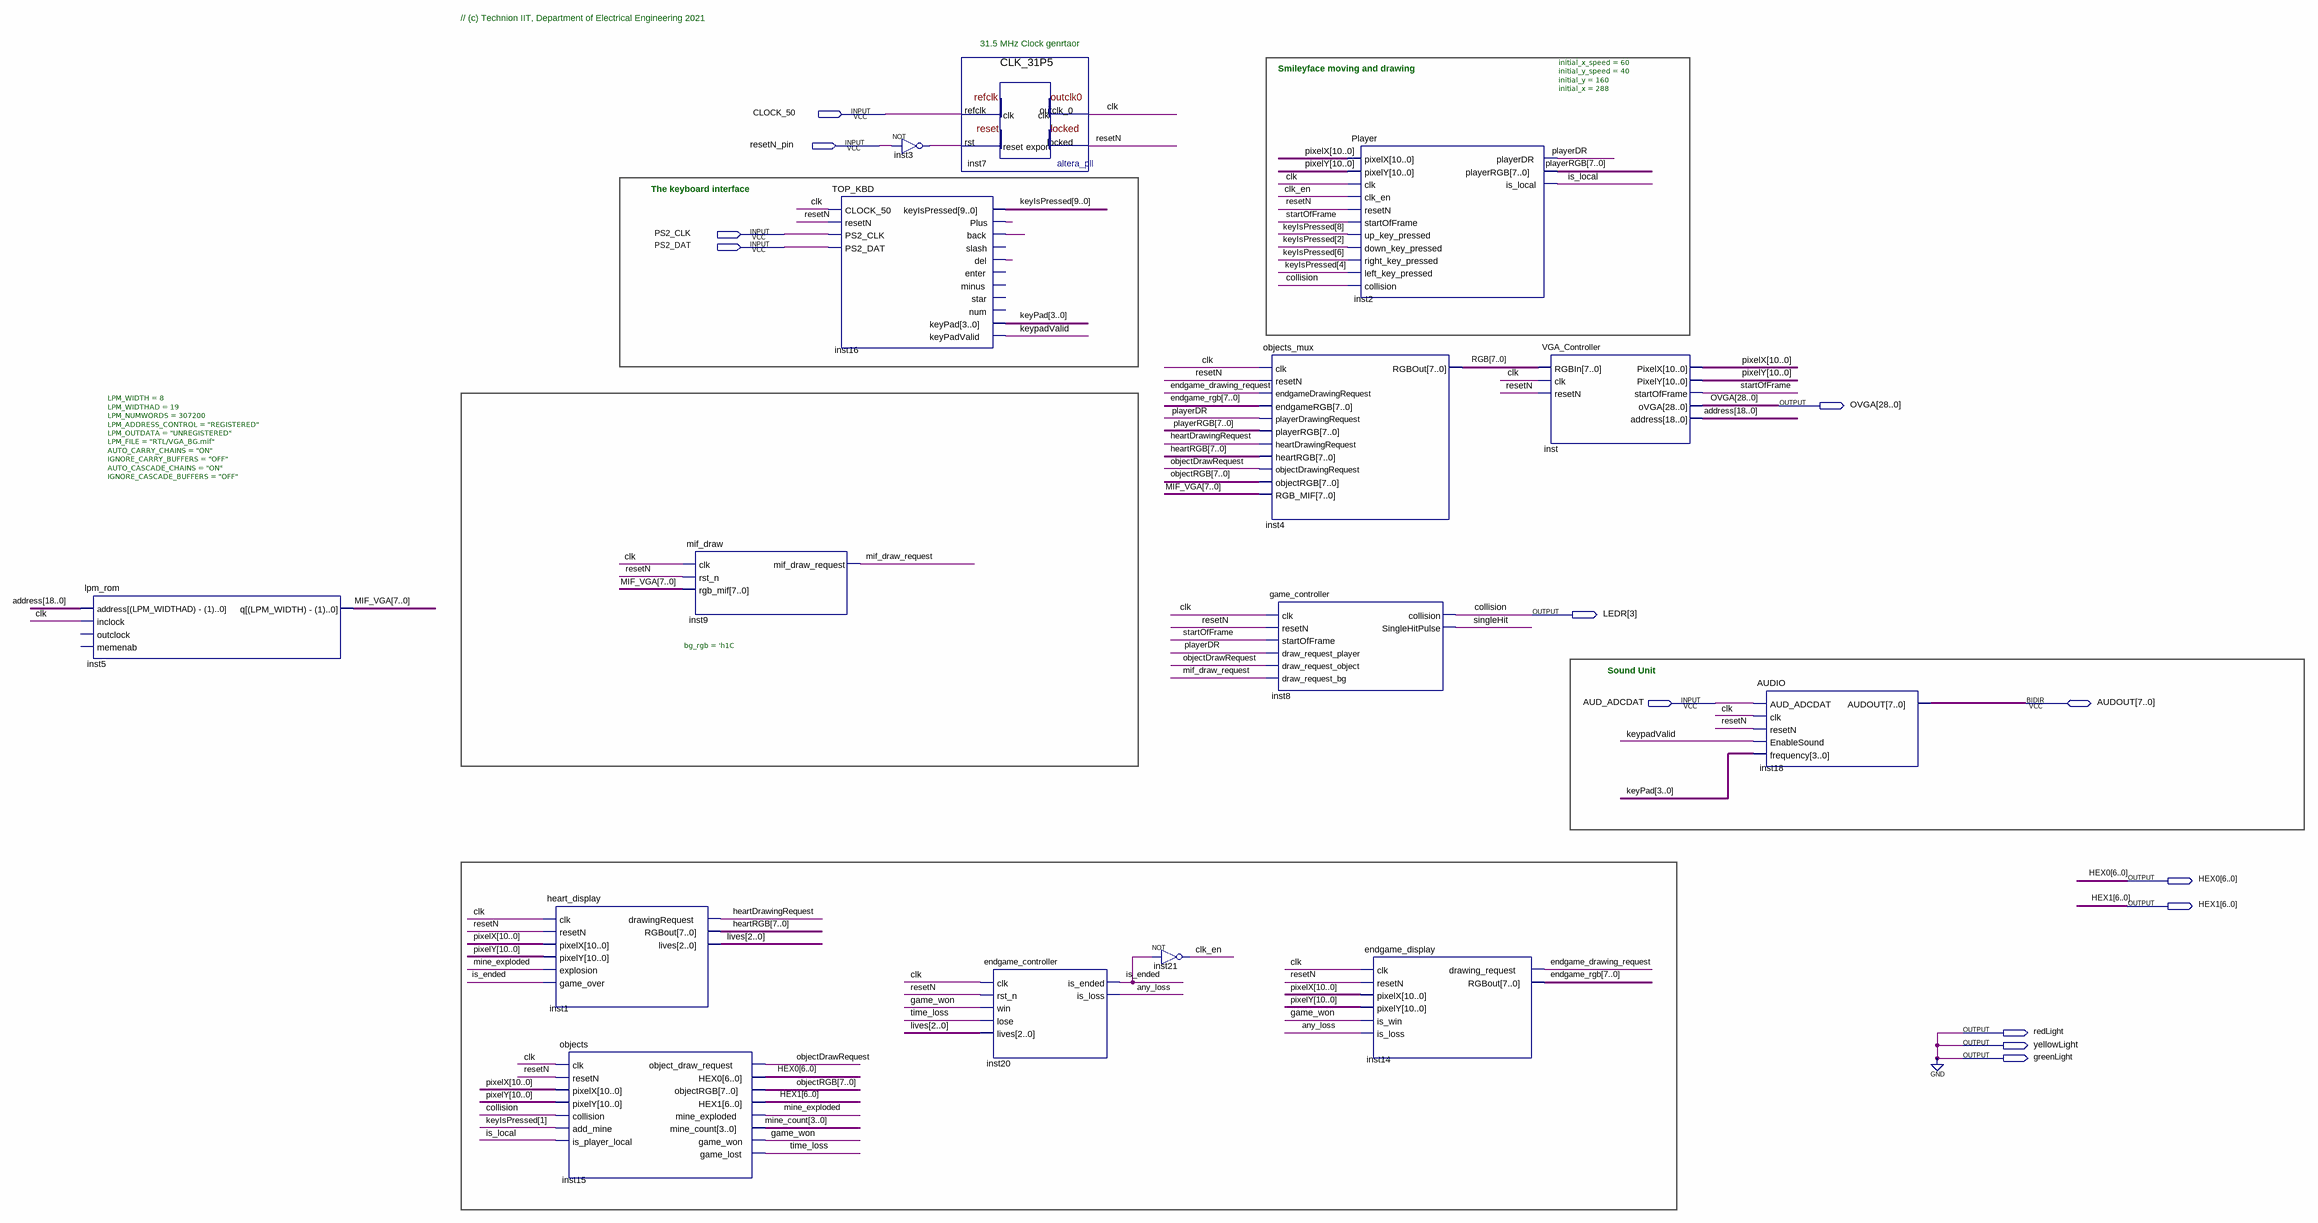
[diagram p0: schematic sheet]
// Quartus schematic TOP.bdf as structural Verilog: 15 symbols, 13 pins
module TOP (
  input  CLOCK_50,
  input  resetN_pin,
  input  PS2_CLK,
  input  PS2_DAT,
  input  AUD_ADCDAT,
  inout  [7:0] AUDOUT,
  output [28:0] OVGA,
  output [3:3] LEDR,
  output [6:0] HEX0,
  output [6:0] HEX1,
  output redLight,
  output yellowLight,
  output greenLight
);

  wire any_loss, clk, clk_en, endgame_drawing_request, game_won, heartDrawingRequest, inst3_out, inst16_back,
       inst16_del, inst16_plus, is_ended, is_local, keypadValid, mif_draw_request, mine_exploded,
       objectDrawRequest, playerDR, resetN, singleHit, startOfFrame, time_loss;
  wire [2:0] lives;
  wire [3:0] keyPad, mine_count;
  wire [7:0] endgame_rgb, heartRGB, MIF_VGA, objectRGB, playerRGB, RGB;
  wire [9:0] keyIsPressed;
  wire [10:0] pixelX, pixelY;
  wire [18:0] address;

  lpm_rom #(.LPM_WIDTH(8), .LPM_WIDTHAD(19), .LPM_NUMWORDS(307200), .LPM_ADDRESS_CONTROL("REGISTERED"), .LPM_OUTDATA("UNREGISTERED"), .LPM_FILE("RTL/VGA_BG.mif"), .AUTO_CARRY_CHAINS("ON"), .IGNORE_CARRY_BUFFERS("OFF"), .AUTO_CASCADE_CHAINS("ON"), .IGNORE_CASCADE_BUFFERS("OFF")) inst5 (
    .address(address), .inclock(clk), .q(MIF_VGA));  // open: outclock, memenab
  heart_display inst1 (
    .clk(clk), .resetN(resetN), .pixelX(pixelX), .pixelY(pixelY), .explosion(mine_exploded),
    .game_over(is_ended), .drawingRequest(heartDrawingRequest), .RGBout(heartRGB), .lives(lives));
  objects inst15 (
    .clk(clk), .resetN(resetN), .pixelX(pixelX), .pixelY(pixelY), .collision(LEDR[3]),
    .add_mine(keyIsPressed[1]), .is_player_local(is_local), .object_draw_request(objectDrawRequest),
    .HEX0(HEX0), .objectRGB(objectRGB), .HEX1(HEX1), .mine_exploded(mine_exploded), .mine_count(mine_count),
    .game_won(game_won), .game_lost(time_loss));
  mif_draw #(.bg_rgb('h1C)) inst9 (.clk(clk), .rst_n(resetN), .rgb_mif(MIF_VGA), .mif_draw_request(mif_draw_request));
  TOP_KBD inst16 (
    .CLOCK_50(clk), .resetN(resetN), .PS2_CLK(PS2_CLK), .PS2_DAT(PS2_DAT), .keyIsPressed(keyIsPressed),
    .Plus(inst16_plus), .back(inst16_back), .del(inst16_del), .keyPad(keyPad), .keyPadValid(keypadValid));  // open: slash, enter, minus, star, num
  not inst3 (inst3_out, resetN_pin);
  CLK_31P5 inst7 (.refclk(CLOCK_50), .rst(inst3_out), .outclk_0(clk), .locked(resetN));
  endgame_controller inst20 (
    .clk(clk), .rst_n(resetN), .win(game_won), .lose(time_loss), .lives(lives), .is_ended(is_ended),
    .is_loss(any_loss));
  not inst21 (clk_en, is_ended);
  objects_mux inst4 (
    .clk(clk), .resetN(resetN), .endgameDrawingRequest(endgame_drawing_request), .endgameRGB(endgame_rgb),
    .playerDrawingRequest(playerDR), .playerRGB(playerRGB), .heartDrawingRequest(heartDrawingRequest),
    .heartRGB(heartRGB), .objectDrawingRequest(objectDrawRequest), .objectRGB(objectRGB), .RGB_MIF(MIF_VGA),
    .RGBOut(RGB));
  game_controller inst8 (
    .clk(clk), .resetN(resetN), .startOfFrame(startOfFrame), .draw_request_player(playerDR),
    .draw_request_object(objectDrawRequest), .draw_request_bg(mif_draw_request), .collision(LEDR[3]),
    .SingleHitPulse(singleHit));
  Player #(.initial_x_speed(60), .initial_y_speed(40), .initial_y(160), .initial_x(288)) inst2 (
    .pixelX(pixelX), .pixelY(pixelY), .clk(clk), .clk_en(clk_en), .resetN(resetN),
    .startOfFrame(startOfFrame), .up_key_pressed(keyIsPressed[8]), .down_key_pressed(keyIsPressed[2]),
    .right_key_pressed(keyIsPressed[6]), .left_key_pressed(keyIsPressed[4]), .collision(LEDR[3]),
    .playerDR(playerDR), .playerRGB(playerRGB), .is_local(is_local));
  endgame_display inst14 (
    .clk(clk), .resetN(resetN), .pixelX(pixelX), .pixelY(pixelY), .is_win(game_won), .is_loss(any_loss),
    .drawing_request(endgame_drawing_request), .RGBout(endgame_rgb));
  VGA_Controller inst (
    .RGBIn(RGB), .clk(clk), .resetN(resetN), .PixelX(pixelX), .PixelY(pixelY), .startOfFrame(startOfFrame),
    .oVGA(OVGA), .address(address));
  AUDIO inst18 (
    .AUD_ADCDAT(AUD_ADCDAT), .clk(clk), .resetN(resetN), .EnableSound(keypadValid), .frequency(keyPad),
    .AUDOUT(AUDOUT));

  assign greenLight = 1'b0;
  assign redLight = 1'b0;
  assign yellowLight = 1'b0;

  // Other names for the same wires on the sheet: collision = LEDR[3]

  // Notes on the sheet:
  //   // (c) Technion IIT, Department of Electrical Engineering 2021
  //   31.5 MHz Clock genrtaor
  //   Smileyface moving and drawing
  //   The keyboard interface
  //   Sound Unit
endmodule
